# Altium schematic sheet Control.SchDoc
size A4
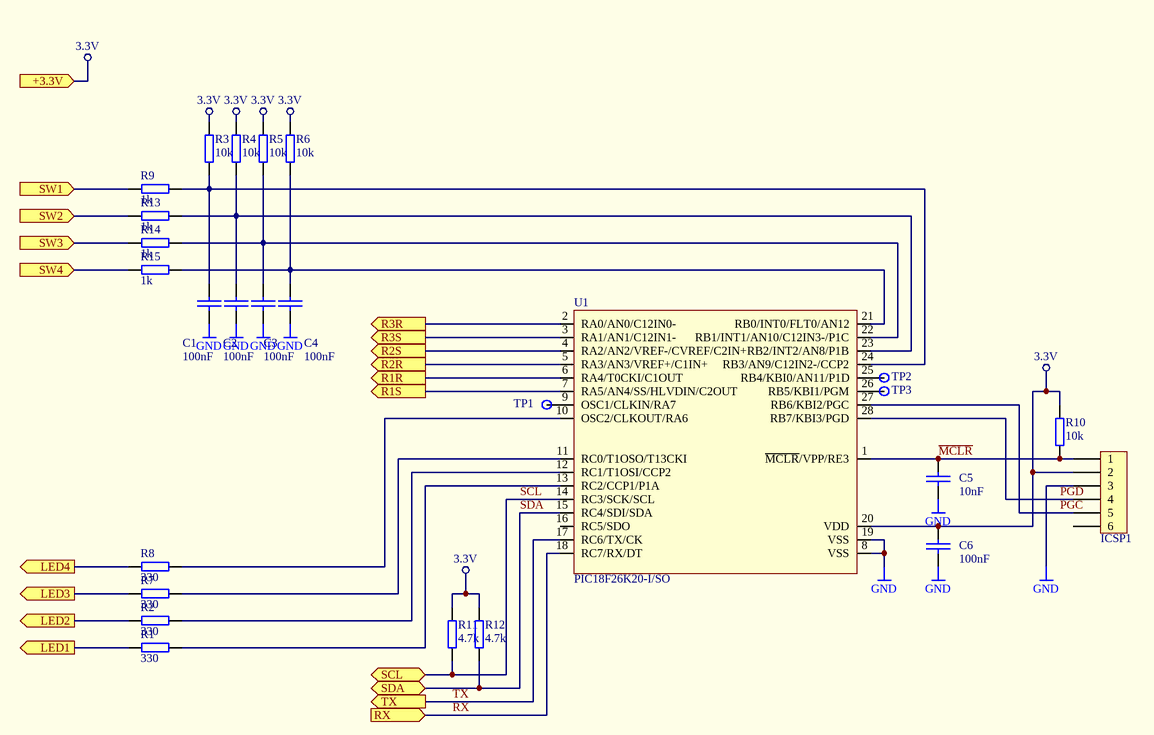
[diagram p0: Control.SchDoc]

## Parts
C1  100nF  [0805_1]
C2  100nF  [0805_1]
C3  100nF  [0805_1]
C4  100nF  [0805_1]
C5  10nF  [0805_1]
C6  100nF  [0805_1]
ICSP1  CON6  [JP6]  (value not drawn)
R1  330  [0805_1]
R2  330  [0805_1]
R3  10k  [0805_1]
R4  10k  [0805_1]
R5  10k  [0805_1]
R6  10k  [0805_1]
R7  330  [0805_1]
R8  330  [0805_1]
R9  1k  [0805_1]
R10  10k  [0805_1]
R11  4.7k  [0805_1]
R12  4.7k  [0805_1]
R13  1k  [0805_1]
R14  1k  [0805_1]
R15  1k  [0805_1]
TP1  TESTPAD  [PAD-36/65]  (value not drawn)
TP2  TESTPAD  [PAD-36/65]  (value not drawn)
TP3  TESTPAD  [PAD-36/65]  (value not drawn)
U1  PIC18F26K20-I/SO  [SOIC-28]

## Ports
+3.3V (in), LED1 (out), LED2 (out), LED3 (out), LED4 (out), R1R (out), R1S (out), R2R (out), R2S (out), R3R (out), R3S (out), RX (in), SCL, SDA, SW1 (in), SW2 (in), SW3 (in), SW4 (in), TX (out)

## Nets
3.3V: C6.1 ICSP1.2 R3.2 R4.2 R5.2 R6.2 R10.2 R11.2 R12.2 U1.20(VDD) ; port +3.3V
GND: C1.2 C2.2 C3.2 C4.2 C5.2 C6.2 ICSP1.3 U1.8(VSS) U1.19(VSS)
LED1: R1.1 ; port LED1
LED2: R2.1 ; port LED2
LED3: R7.1 ; port LED3
LED4: R8.1 ; port LED4
~{MCLR}: C5.1 ICSP1.1 R10.1 U1.1(~{MCLR}/VPP/RE3)
PGC: ICSP1.5 U1.27(RB6/KBI2/PGC)
PGD: ICSP1.4 U1.28(RB7/KBI3/PGD)
R1R: U1.6(RA4/T0CKI/C1OUT) ; port R1R
R1S: U1.7(RA5/AN4/SS/HLVDIN/C2OUT) ; port R1S
R2R: U1.5(RA3/AN3/VREF+/C1IN+) ; port R2R
R2S: U1.4(RA2/AN2/VREF-/CVREF/C2IN+) ; port R2S
R3R: U1.2(RA0/AN0/C12IN0-) ; port R3R
R3S: U1.3(RA1/AN1/C12IN1-) ; port R3S
RX: U1.18(RC7/RX/DT) ; port RX
SCL: R11.1 U1.14(RC3/SCK/SCL) ; port SCL
SDA: R12.1 U1.15(RC4/SDI/SDA) ; port SDA
SW1: R9.2 ; port SW1
SW2: R13.2 ; port SW2
SW3: R14.2 ; port SW3
SW4: R15.2 ; port SW4
TX: U1.17(RC6/TX/CK) ; port TX
NetC1_1: C1.1 R3.1 R9.1 U1.24(RB3/AN9/C12IN2-/CCP2)
NetC2_1: C2.1 R4.1 R13.1 U1.23(RB2/INT2/AN8/P1B)
NetC3_1: C3.1 R5.1 R14.1 U1.22(RB1/INT1/AN10/C12IN3-/P1C)
NetC4_1: C4.1 R6.1 R15.1 U1.21(RB0/INT0/FLT0/AN12)
NetR1_2: R1.2 U1.13(RC2/CCP1/P1A)
NetR2_2: R2.2 U1.12(RC1/T1OSI/CCP2)
NetR7_2: R7.2 U1.11(RC0/T1OSO/T13CKI)
NetR8_2: R8.2 U1.10(OSC2/CLKOUT/RA6)
NetTP1_1: TP1.1 U1.9(OSC1/CLKIN/RA7)
NetTP2_1: TP2.1 U1.25(RB4/KBI0/AN11/P1D)
NetTP3_1: TP3.1 U1.26(RB5/KBI1/PGM)

Not connected (* = marked no-connect by the designer): ICSP1 6; U1 16(RC5/SDO)

## Library data of the parts
C1-C6 = CAP: Capacitor
ICSP1 = CON6: Connector
R1-R15 = RES: Resistor
U1 = PIC18F26K20-I/SO: PIC18 mid-range mcu